# Altium project AltiumLibrary2Test0.PrjPcb
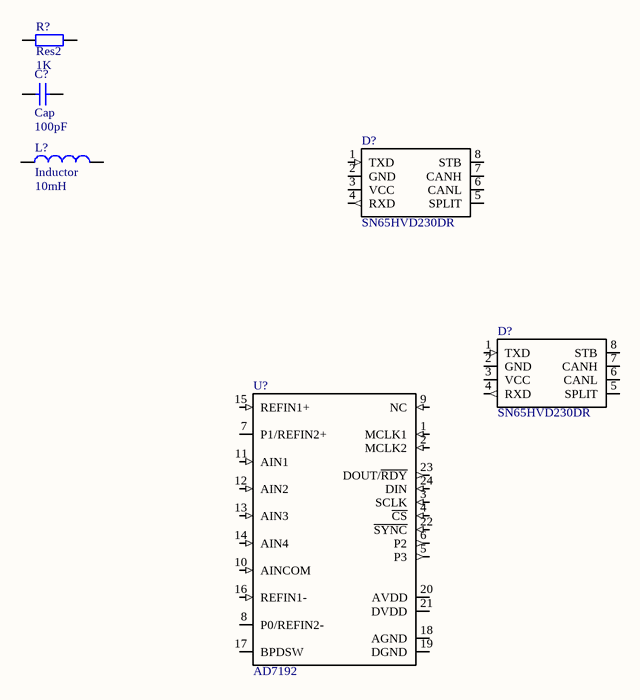
[diagram p0: Sch0.SchDoc]
1 sheet, 6 parts. Net scope: global (net labels, ports and power ports of the same name join across sheets).

## Sheet Sch0.SchDoc
size A

### Parts
(Parts that share a designator on the sheet are numbered #1, #2 ... from top to bottom, then left to right.)
C?  Cap  value 100pF  [RAD-0.3]
D?#1  SN65HVD230DR  [SOIC127P600X175-8N]
D?#2  SN65HVD230DR  [SOIC127P600X175-8N]
L?  Inductor  value 10mH  [0402-A]
R?  Res2  value 1K  [AXIAL-0.4]
U?  AD7192  [TSOP65P640X120-24N]

### Nets

Not connected (* = marked no-connect by the designer): C? 1 2; D?#1 1(TXD) 2(GND) 3(VCC) 4(RXD) 5(SPLIT) 6(CANL) 7(CANH) 8(STB); D?#2 1(TXD) 2(GND) 3(VCC) 4(RXD) 5(SPLIT) 6(CANL) 7(CANH) 8(STB); L? 1 2; R? 1 2; U? 1(MCLK1) 2(MCLK2) 3(SCLK) 4(~{CS}) 5(P3) 6(P2) 7(P1/REFIN2+) 8(P0/REFIN2-) 9(NC) 10(AINCOM) 11(AIN1) 12(AIN2) 13(AIN3) 14(AIN4) 15(REFIN1+) 16(REFIN1-) 17(BPDSW) 18(AGND) 19(DGND) 20(AVDD) 21(DVDD) 22(~{SYNC}) 23(DOUT/~{RDY}) 24(DIN)

### Library data of the parts
C? = Cap: Capacitor; Published: 8-Jun-2000; LatestRevisionDate: 17-Jul-2002; LatestRevisionNote: Re-released for DXP Platform.; PackageReference: RAD-0.3; Publisher: Altium Limited; PackageDescription: Radial Cap, Thru-Hole; 2 Leads; 0.3 in Pin Spacing
D?#1 D?#2 = SN65HVD230DR: CAN transceiver with standby; Manufacturer: TI; Description-en: IC SOIC-8-N; Description-ru: Микросхема SOIC-8-N; Part Number: SN65HVD230DR; Name: SN65HVD230DR; Package: SOIC-8-N; Pin count: 8; Component Type: Standard; Author: Prishchepenko Boris
L? = Inductor: Code_IEC: 1005; Published: 8-Jun-2000; LatestRevisionDate: 29-May-2009; LatestRevisionNote: IPC-7351 Footprint Added.; PackageReference: 0402-A; Publisher: Altium Limited; PackageDescription: Chip Inductor; Code_JEITA: 0402
R? = Res2: Resistor; Published: 8-Jun-2000; LatestRevisionDate: 17-Jul-2002; LatestRevisionNote: Re-released for DXP Platform.; PackageReference: AXIAL-0.4; Publisher: Altium Limited; PackageDescription: Axial Device, Thru-Hole; 2 Leads; 0.4 in Pin Spacing
U? = AD7192BRUZ: Manufacturer: AD; Description-en: IC; Type-en: ADC 24-bit; Description-ru: Микросхема; Type-ru: АЦП 24-бит; Name: AD7192; Part Number: AD7192BRUZ; Package: TSOP-24; Pin count: 24; Component Type: Standard; Author: Prishchepenko Boris